# Altium schematic sheet Processor.SchDoc
size A4; DocumentNumber: 4; SheetNumber: 4; SheetTotal: 6
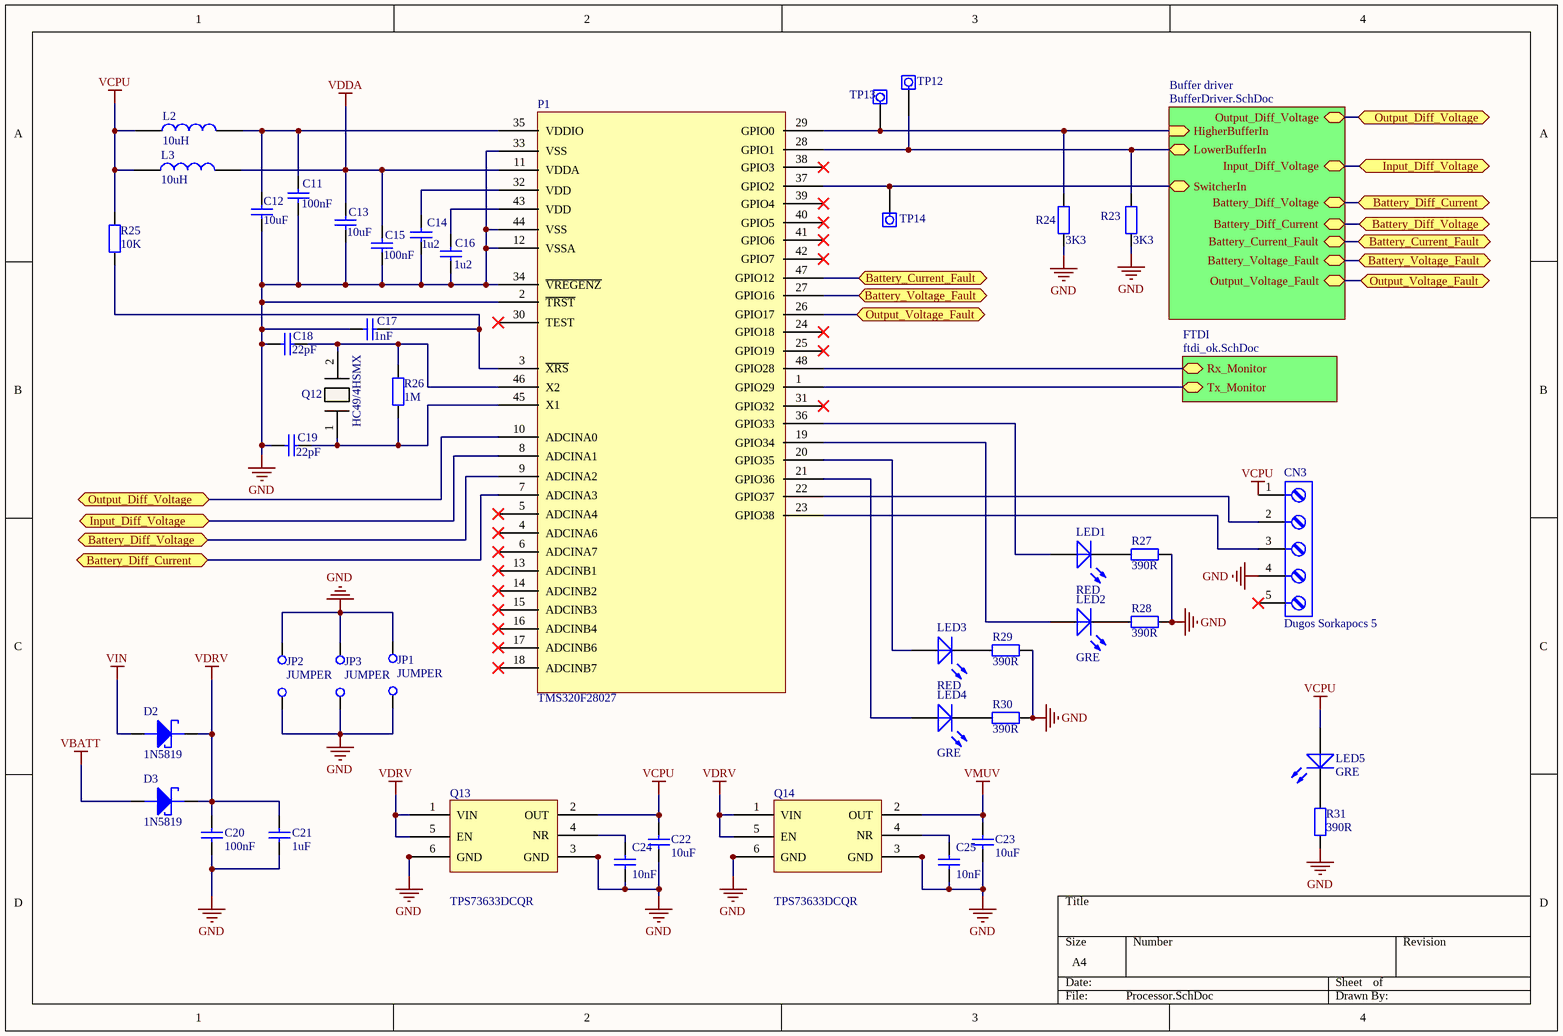
[diagram p0: Processor.SchDoc]

## Parts
C11  100nF  [FP_0805_CAP_085]
C12  10uF  [FP_0805_CAP_085]
C13  10uF  [FP_0805_CAP_085]
C14  1u2  [FP_1206_CAP_125]
C15  100nF  [FP_0805_CAP_085]
C16  1u2  [FP_1206_CAP_125]
C17  1nF  [FP_0805_CAP_085]
C18  22pF  [FP_0805_CAP_085]
C19  22pF  [FP_0805_CAP_085]
C20  100nF  [FP_0805_CAP_085]
C21  1uF  [FP_0805_CAP_085]
C22  10uF  [FP_0805_CAP_085]
C23  10uF  [FP_0805_CAP_085]
C24  10nF  [FP_0805_CAP_085]
C25  10nF  [FP_0805_CAP_085]
CN3  Dugos Sorkapocs 5  [FP_CONN4_TUSKE_254MM]
D2  1N5819  [AXIAL-0.3]
D3  1N5819  [AXIAL-0.3]
JP1  JUMPER  [FP_CONN2_TUSKE_254MM]
JP2  JUMPER  [FP_CONN2_TUSKE_254MM]
JP3  JUMPER  [FP_CONN2_TUSKE_254MM]
L2  10uH  [AXIAL-0.3]
L3  10uH  [AXIAL-0.3]
LED1  RED  [FP_LED_TH_RED]
LED2  GRE  [FP_LED_TH_GREEN]
LED3  RED  [FP_LED_TH_RED]
LED4  GRE  [FP_LED_TH_GREEN]
LED5  GRE  [FP_LED_TH_GREEN]
P1  TMS320F28027  [S-PQFP48]
Q12  HC49/4HSMX  [Crystal_10MHz]
Q13  TPS73633DCQR  [TPS73633]
Q14  TPS73633DCQR  [TPS73633]
R23  3K3  [FP_0805_RES]
R24  3K3  [FP_0805_RES]
R25  10K  [FP_0805_RES]
R26  1M  [FP_0805_RES]
R27  390R  [AXIAL-0.3]
R28  390R  [AXIAL-0.3]
R29  390R  [AXIAL-0.3]
R30  390R  [AXIAL-0.3]
R31  390R  [AXIAL-0.3]
TP12  Testpoint  [TESTPOINT_1.5]  (value not drawn)  (no BOM)
TP13  Testpoint  [TESTPOINT_1.5]  (value not drawn)  (no BOM)
TP14  Testpoint  [TESTPOINT_1.5]  (value not drawn)  (no BOM)

## Sub-sheets
Buffer driver = BufferDriver.SchDoc: HigherBufferIn (in), LowerBufferIn (bidir), SwitcherIn, Output_Diff_Voltage, Input_Diff_Voltage, Battery_Diff_Voltage, Battery_Diff_Current, Battery_Current_Fault, Battery_Voltage_Fault, Output_Voltage_Fault
FTDI = ftdi_ok.SchDoc: Rx_Monitor, Tx_Monitor

## Ports
Battery_Current_Fault, Battery_Diff_Current, Battery_Diff_Voltage, Battery_Voltage_Fault, Input_Diff_Voltage, Output_Diff_Voltage, Output_Voltage_Fault

## Nets
GND: C11.1 C12.1 C13.1 C14.1 C15.2 C16.1 C17.1 C18.1 C19.1 C20.1 C21.1 C22.1 C23.1 C24.1 C25.1 CN3.4 JP1.1(C1) JP1.2(C2) JP2.1(C1) JP2.2(C2) JP3.1(C1) JP3.2(C2) P1.2(~{TRST}) P1.12(VSSA) P1.33(VSS) P1.34(~{VREGENZ}) P1.44(VSS) Q13.3(GND) Q13.6(GND) Q14.3(GND) Q14.6(GND) R23.2 R24.1 R27.1 R28.1 R29.1 R30.1 R31.1
VBATT: D3.2(ANODE)
VCPU: C22.2 CN3.1 L2.1 L3.1 LED5.1(A) Q13.2(OUT) R25.2
VDDA: C13.2 C15.1 L3.2 P1.11(VDDA)
VDRV: C20.2 C21.2 D2.1(CATHODE) D3.1(CATHODE) Q13.1(VIN) Q13.5(EN) Q14.1(VIN) Q14.5(EN)
VIN: D2.2(ANODE)
VMUV: C23.2 Q14.2(OUT)
Battery_Current_Fault: P1.47(GPIO12) ; port Battery_Current_Fault, sheet Buffer driver/Battery_Current_Fault
Battery_Diff_Current: P1.7(ADCINA3) ; port Battery_Diff_Current, sheet Buffer driver/Battery_Diff_Voltage
Battery_Diff_Voltage: P1.9(ADCINA2) ; port Battery_Diff_Voltage, sheet Buffer driver/Battery_Diff_Current
Battery_Voltage_Fault: P1.27(GPIO16) ; port Battery_Voltage_Fault, sheet Buffer driver/Battery_Voltage_Fault
Input_Diff_Voltage: P1.8(ADCINA1) ; port Input_Diff_Voltage, sheet Buffer driver/Input_Diff_Voltage
Output_Diff_Voltage: P1.10(ADCINA0) ; port Output_Diff_Voltage, sheet Buffer driver/Output_Diff_Voltage
Output_Voltage_Fault: P1.26(GPIO17) ; port Output_Voltage_Fault, sheet Buffer driver/Output_Voltage_Fault
NetC11_2: C11.2 C12.2 L2.2 P1.35(VDDIO)
NetC14_2: C14.2 P1.32(VDD)
NetC16_2: C16.2 P1.43(VDD)
NetC17_2: C17.2 P1.3(~{XRS}) R25.1
NetC18_2: C18.2 P1.46(X2) Q12.2(X2) R26.2
NetC19_2: C19.2 P1.45(X1) Q12.1(X1) R26.1
NetC24_2: C24.2 Q13.4(NR)
NetC25_2: C25.2 Q14.4(NR)
NetCN3_2: CN3.2 P1.22(GPIO37)
NetCN3_3: CN3.3 P1.23(GPIO38)
NetLED1_1: LED1.1(A) P1.36(GPIO33)
NetLED1_2: LED1.2(K) R27.2
NetLED2_1: LED2.1(A) P1.19(GPIO34)
NetLED2_2: LED2.2(K) R28.2
NetLED3_1: LED3.1(A) P1.20(GPIO35)
NetLED3_2: LED3.2(K) R29.2
NetLED4_1: LED4.1(A) P1.21(GPIO36)
NetLED4_2: LED4.2(K) R30.2
NetLED5_2: LED5.2(K) R31.2
NetP1_1: P1.1(GPIO29) ; sheet FTDI/Tx_Monitor
NetP1_28: P1.28(GPIO1) R23.1 TP12.1 ; sheet Buffer driver/LowerBufferIn
NetP1_29: P1.29(GPIO0) R24.2 TP13.1 ; sheet Buffer driver/HigherBufferIn
NetP1_37: P1.37(GPIO2) TP14.1 ; sheet Buffer driver/SwitcherIn
NetP1_48: P1.48(GPIO28) ; sheet FTDI/Rx_Monitor

Not connected (* = marked no-connect by the designer): CN3 5*; P1 4(ADCINA6)* 5(ADCINA4)* 6(ADCINA7)* 13(ADCINB1)* 14(ADCINB2)* 15(ADCINB3)* 16(ADCINB4)* 17(ADCINB6)* 18(ADCINB7)* 24(GPIO18)* 25(GPIO19)* 30(TEST)* 31(GPIO32)* 38(GPIO3)* 39(GPIO4)* 40(GPIO5)* 41(GPIO6)* 42(GPIO7)*

## Library data of the parts
C11-C25 = CAP: Capacitor
  C11 C15 C20: Value: 100nF; Lomex NR: 82-07-32
  C12 C13 C22 C23: Value: 10uF; Lomex NR: 82-08-32
  C14 C16: Value: 1u2; Lomex NR: 82-05-93
  C17: Value: 1nF; Lomex NR: 82-00-75
  C18 C19: Value: 22pF; Lomex NR: 82-09-18
  C21: Value: 1uF; Lomex NR: 82-05-11
  C24 C25: Value: 10nF; Lomex NR: 82-05-66
CN3 = Dugos Sorkapocs 5: SORKAPOCS 5 P RM5.08 CSAPSORLÉC 90° ZÁRT 12A; Part Class: Connector; K_manufacturer: (STE); Order Code: 43-07-79, 43-07-78; CompType: CPM5.08/5SQ, CPF5.08/5; Value: 5P; Distributor: Lomex; Package: RM5.08
D2 D3 = SCHOTTKY: NXP - PMEG3020EJ,115 - SCHOTTKY RECT 30V 2A SOD323F; Supplier: 16-04-12; Type: 1N5819
JP1-JP3 = JUMPER: Jumper Wire; Supplier: Farnell 1668537×1/6
L2 L3 = IND: Inductor; Value: 10uH; Lomex NR: 55-00-65
LED1 LED3 = LED: Part Class: Semiconductor; K_Manufacturer: Kingbright; CompType: KP-3216SRD-PRV; Distributor: Lomex; Order Code: 95-00-28; Package: 1206; Value: RED
LED2 LED4 LED5 = LED: Part Class: Semiconductor; K_Manufacturer: Kingbright; CompType: KP-3216SGD; Distributor: Lomex; Order Code: 95-00-26; Package: 1206; Value: GRE
P1 = TMS320F28027: Processor
Q12 = HC49/4HSMX: kristály
Q13 Q14 = TPS73633DCQR: proci táp 3V3
R23-R26 = RES: Resistor
  R23 R24: Value: 3K3
  R25: Value: 10K
  R26: Value: 1M
R27-R31 = Resistor: K_Manufacturer: Viking Tech Corp.; CompType: CR-05JL7--390R; Distributor: Lomex; Order Code: 81-10-82; Package: 0805; Part Class: Resistor; Value: 390R
TP12-TP14 = Testpoint: Part Class: Connector